# Altium project BIOLAB.PrjPcb
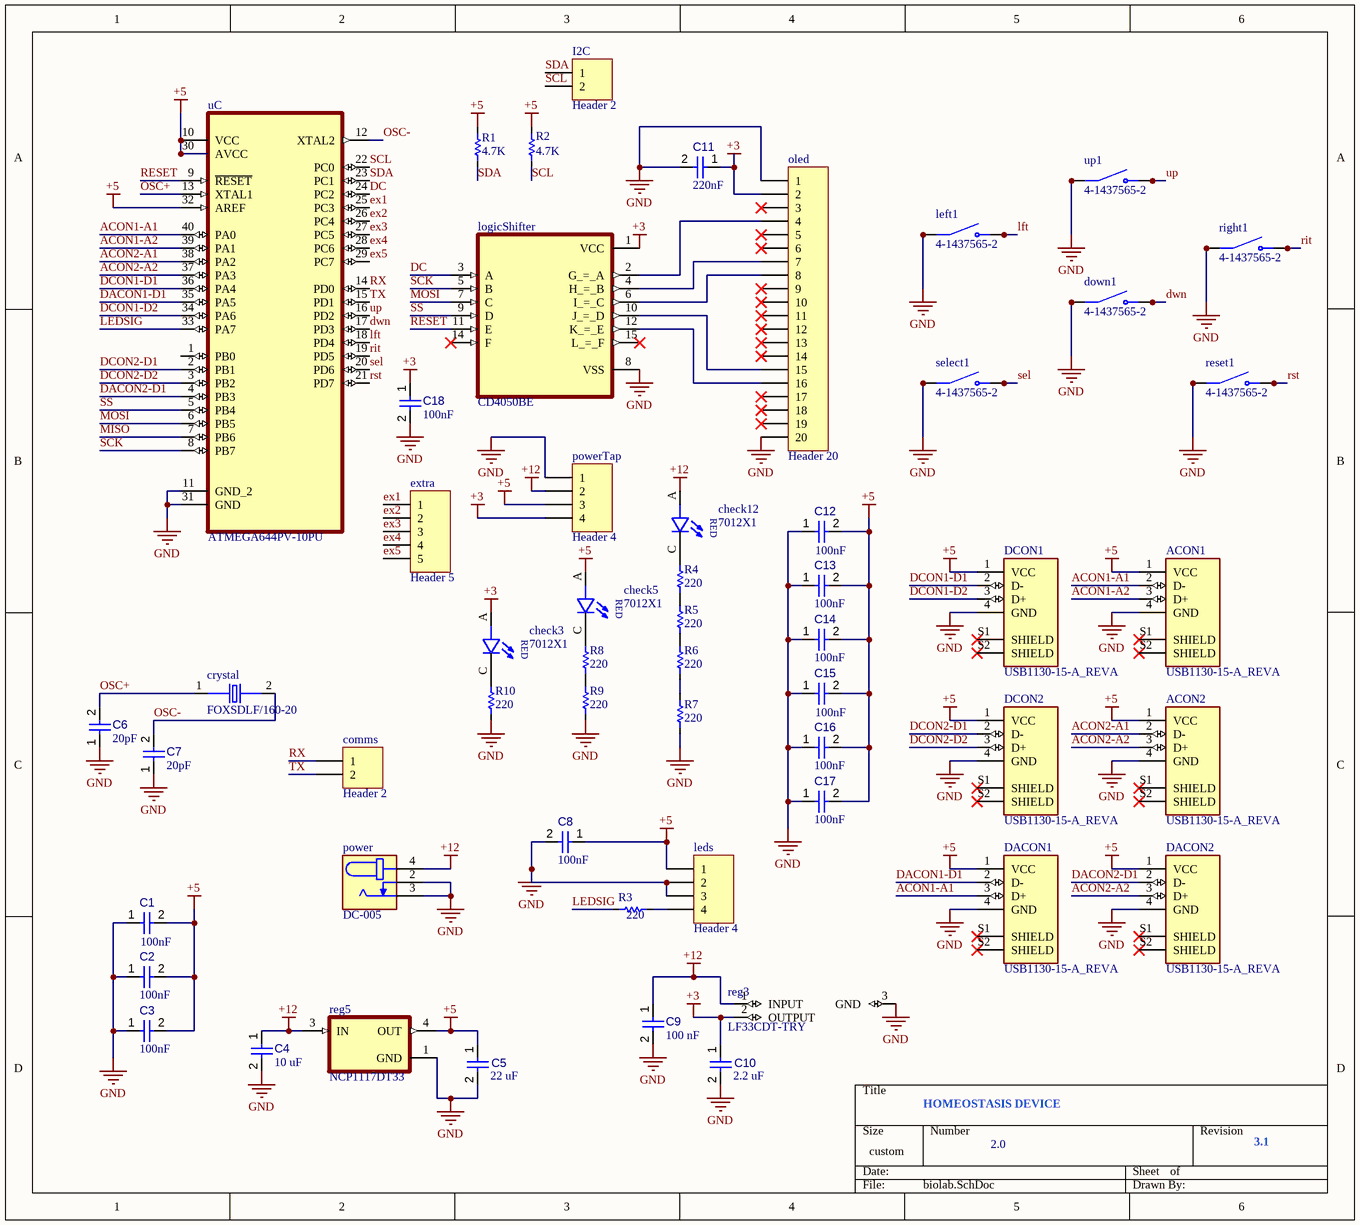
[diagram p0: biolab.SchDoc]
1 sheet, 55 parts. Net scope: global (net labels, ports and power ports of the same name join across sheets).
Board file: biolab.PcbDoc

## Sheet biolab.SchDoc
size 254 x 228 mm; SheetNumber: 1; SheetTotal: 1

### Parts
ACON1  USB1130-15-A_REVA  [GCT_USB1130-15-A_REVA]
ACON2  USB1130-15-A_REVA  [GCT_USB1130-15-A_REVA]
C1  value 100nF  [CAPC0805(2012)145_L]  (hidden comment: Capacitor 4.7µF +/-40% 25V 0805)
C2  value 100nF  [CAPC0805(2012)145_L]  (hidden comment: Capacitor 4.7µF +/-40% 25V 0805)
C3  value 100nF  [CAPC0805(2012)145_L]  (hidden comment: Capacitor 4.7µF +/-40% 25V 0805)
C4  value 10 uF  [CAPC0805(2012)145_L]  (hidden comment: Capacitor 4.7µF +/-40% 25V 0805)
C5  value 22 uF  [CAPC0805(2012)145_L]  (hidden comment: Capacitor 4.7µF +/-40% 25V 0805)
C6  value 20pF  [CAPC2013X135X45ML10T25]  (hidden comment: Capacitor 1 uF +/- 10% 50 V 0805)
C7  value 20pF  [CAPC2013X135X45ML10T25]  (hidden comment: Capacitor 1 uF +/- 10% 50 V 0805)
C8  value 100nF  [CAPC0805(2012)145_L]  (hidden comment: Capacitor 4.7µF +/-40% 25V 0805)
C9  value 100 nF  [CAPC0805(2012)145_L]  (hidden comment: Capacitor 4.7µF +/-40% 25V 0805)
C10  value 2.2 uF  [CAPC0805(2012)145_L]  (hidden comment: Capacitor 4.7µF +/-40% 25V 0805)
C11  value 220nF  [CAPC0805(2012)145_L]  (hidden comment: Capacitor 4.7µF +/-40% 25V 0805)
C12  value 100nF  [CAPC0805(2012)145_L]  (hidden comment: Capacitor 4.7µF +/-40% 25V 0805)
C13  value 100nF  [CAPC0805(2012)145_L]  (hidden comment: Capacitor 4.7µF +/-40% 25V 0805)
C14  value 100nF  [CAPC0805(2012)145_L]  (hidden comment: Capacitor 4.7µF +/-40% 25V 0805)
C15  value 100nF  [CAPC0805(2012)145_L]  (hidden comment: Capacitor 4.7µF +/-40% 25V 0805)
C16  value 100nF  [CAPC0805(2012)145_L]  (hidden comment: Capacitor 4.7µF +/-40% 25V 0805)
C17  value 100nF  [CAPC0805(2012)145_L]  (hidden comment: Capacitor 4.7µF +/-40% 25V 0805)
C18  value 100nF  [CAPC0805(2012)145_L]  (hidden comment: Capacitor 4.7µF +/-40% 25V 0805)
check3  7012X1  [LED_7012X1]
check5  7012X1  [LED_7012X1]
check12  7012X1  [LED_7012X1]
comms  Header 2  [HDR1X2]
crystal  FOXSDLF/160-20  [XTAL_FOXSDLF/160-20]
DACON1  USB1130-15-A_REVA  [GCT_USB1130-15-A_REVA]
DACON2  USB1130-15-A_REVA  [GCT_USB1130-15-A_REVA]
DCON1  USB1130-15-A_REVA  [GCT_USB1130-15-A_REVA]
DCON2  USB1130-15-A_REVA  [GCT_USB1130-15-A_REVA]
down1  4-1437565-2  [SW_4-1437565-2]
extra  Header 5  [HDR1X5]
I2C  Header 2  [HDR1X2]
leds  Header 4  [HDR1X4]
left1  4-1437565-2  [SW_4-1437565-2]
logicShifter  CD4050BE  [DIP794W45P254L1969H508Q16]
oled  Header 20  [HDR1X20]
power  DC-005  [NINIGI_DC-005]
powerTap  Header 4  [HDR1X4]
R1  value 4.7K  [0805_Resistor]  (hidden comment: R_0805_4.7K_1%)
R2  value 4.7K  [0805_Resistor]  (hidden comment: R_0805_4.7K_1%)
R3  value 220  [0805_Resistor]  (hidden comment: R_0805_4.7K_1%)
R4  value 220  [0805_Resistor]  (hidden comment: R_0805_4.7K_1%)
R5  value 220  [0805_Resistor]  (hidden comment: R_0805_4.7K_1%)
R6  value 220  [0805_Resistor]  (hidden comment: R_0805_4.7K_1%)
R7  value 220  [0805_Resistor]  (hidden comment: R_0805_4.7K_1%)
R8  value 220  [0805_Resistor]  (hidden comment: R_0805_4.7K_1%)
R9  value 220  [0805_Resistor]  (hidden comment: R_0805_4.7K_1%)
R10  value 220  [0805_Resistor]  (hidden comment: R_0805_4.7K_1%)
reg3  LF33CDT-TRY  [LD1117DT33]
reg5  NCP1117DT33  [VREG_NCP1117DT33]
reset1  4-1437565-2  [SW_4-1437565-2]
right1  4-1437565-2  [SW_4-1437565-2]
select1  4-1437565-2  [SW_4-1437565-2]
uC  ATMEGA644PV-10PU  [DIP254P1524X483-40]
up1  4-1437565-2  [SW_4-1437565-2]

### Nets
+3: C10.1 C11.1 C18.1 check3.A logicShifter.1(VCC) oled.2 powerTap.4 reg3.2(OUTPUT)
+5: ACON1.1(VCC) ACON2.1(VCC) C1.2 C2.2 C3.2 C5.1 C8.1 C12.2 C13.2 C14.2 C15.2 C16.2 C17.2 check5.A DACON1.1(VCC) DACON2.1(VCC) DCON1.1(VCC) DCON2.1(VCC) leds.1 powerTap.3 R1.1 R2.1 reg5.4(OUT) uC.10(VCC) uC.30(AVCC) uC.32(AREF)
+12: C4.1 C9.1 check12.A power.4 powerTap.2 reg3.1(INPUT) reg5.3(IN)
GND: ACON1.4(GND) ACON2.4(GND) C1.1 C2.1 C3.1 C4.2 C5.2 C6.1 C7.1 C8.2 C9.2 C10.2 C11.2 C12.1 C13.1 C14.1 C15.1 C16.1 C17.1 C18.2 DACON1.4(GND) DACON2.4(GND) DCON1.4(GND) DCON2.4(GND) down1.1(COM) down1.2(COM) leds.2 leds.3 left1.1(COM) left1.2(COM) logicShifter.8(VSS) oled.1 oled.20 power.2 power.3 powerTap.1 R7.1 R9.1 R10.1 reg3.3(GND) reg5.1(GND) reset1.1(COM) reset1.2(COM) right1.1(COM) right1.2(COM) select1.1(COM) select1.2(COM) uC.11(GND_2) uC.31(GND) up1.1(COM) up1.2(COM)
ACON1-A1: ACON1.2(D-) DACON1.3(D+) uC.40(PA0)
ACON1-A2: ACON1.3(D+) uC.39(PA1)
ACON2-A1: ACON2.2(D-) uC.38(PA2)
ACON2-A2: ACON2.3(D+) DACON2.3(D+) uC.37(PA3)
DACON1-D1: DACON1.2(D-) uC.35(PA5)
DACON2-D1: DACON2.2(D-) uC.4(PB3)
DC: logicShifter.3(A) uC.24(PC2)
DCON1-D1: DCON1.2(D-) uC.36(PA4)
DCON1-D2: DCON1.3(D+) uC.34(PA6)
DCON2-D1: DCON2.2(D-) uC.2(PB1)
DCON2-D2: DCON2.3(D+) uC.3(PB2)
dwn: down1.3(NO) down1.4(NO) uC.17(PD3)
ex1: extra.1 uC.25(PC3)
ex2: extra.2 uC.26(PC4)
ex3: extra.3 uC.27(PC5)
ex4: extra.4 uC.28(PC6)
ex5: extra.5 uC.29(PC7)
LEDSIG: R3.1 uC.33(PA7)
lft: left1.3(NO) left1.4(NO) uC.18(PD4)
MISO: uC.7(PB6)
MOSI: logicShifter.7(C) uC.6(PB5)
OSC+: C6.2 crystal.1 uC.13(XTAL1)
OSC-: C7.2 crystal.2 uC.12(XTAL2)
RESET: logicShifter.11(E) uC.9(~{RESET})
rit: right1.3(NO) right1.4(NO) uC.19(PD5)
rst: reset1.3(NO) reset1.4(NO) uC.21(PD7)
RX: comms.1 uC.14(PD0)
SCK: logicShifter.5(B) uC.8(PB7)
SCL: I2C.2 R2.2 uC.22(PC0)
SDA: I2C.1 R1.2 uC.23(PC1)
sel: select1.3(NO) select1.4(NO) uC.20(PD6)
SS: logicShifter.9(D) uC.5(PB4)
TX: comms.2 uC.15(PD1)
up: uC.16(PD2) up1.3(NO) up1.4(NO)
Netcheck3_C: check3.C R10.2
Netcheck5_C: check5.C R8.2
Netcheck12_C: check12.C R4.2
Netleds_4: leds.4 R3.2
NetlogicShifter_2: logicShifter.2(G_=_A) oled.4
NetlogicShifter_4: logicShifter.4(H_=_B) oled.7
NetlogicShifter_6: logicShifter.6(I_=_C) oled.8
NetlogicShifter_10: logicShifter.10(J_=_D) oled.15
NetlogicShifter_12: logicShifter.12(K_=_E) oled.16
NetR4_1: R4.1 R5.2
NetR5_1: R5.1 R6.2
NetR6_1: R6.1 R7.2
NetR8_1: R8.1 R9.2

Not connected (* = marked no-connect by the designer): ACON1 S1(SHIELD)* S2(SHIELD)*; ACON2 S1(SHIELD)* S2(SHIELD)*; DACON1 S1(SHIELD)* S2(SHIELD)*; DACON2 S1(SHIELD)* S2(SHIELD)*; DCON1 S1(SHIELD)* S2(SHIELD)*; DCON2 S1(SHIELD)* S2(SHIELD)*; logicShifter 14(F)* 15(L_=_F)*; oled 3* 5* 6* 9* 10* 11* 12* 13* 14* 17* 18* 19*; uC 1(PB0)

### Notes on the sheet
- HOMEOSTASIS DEVICE
- 2.0
- 3.1
- (in symbol 7012X1) RED

### Library data of the parts
ACON1 ACON2 DACON1 DACON2 DCON1 DCON2 = USB1130-15-A_REVA: MF: {'manufacturer': u'Global Connector Technology'}; MP: USB1130-15-A_REVA; Value: *; Price: None; Package: None; Availability: Unavailable
C1-C5 C8-C18 = CMP-001-00080-5: Chip Capacitor, 4.7µF +/-40%, 25V, 0805, Thickness 1.45 mm; Tolerance: 20%; Capacitor Type: Ceramic; Case/Package: 0805; Max Operating Temperature: 85°C; Mounting Technology: SMT; Min Operating Temperature: -55°C; Voltage Rating: 25V; Pins: 2
C6 C7 = CMP-001-00007-7: Chip Capacitor, 1 uF, +/- 10%, 50 V, 0805 (2012 Metric); Capacitor Type: Ceramic; Voltage Rating: 50V; Mounting Technology: SMT; Tolerance: 10%; Pins: 2; Max Operating Temperature: 125°C; Min Operating Temperature: -55°C; Case/Package: 0805
check3 check5 check12 = 7012X1: Red LED Indication - Discrete 1.7V 0805 (2012 Metric); MF: {'manufacturer': u'Visual'}; Availability: Unavailable; Value: *; Package: None; MP: 7012X1; Price: None
comms I2C = Header 2: Header, 2-Pin; LatestRevisionDate: 17-Jul-2002; LatestRevisionNote: Re-released for DXP Platform.; Publisher: Altium Limited
crystal = FOXSDLF/160-20: Crystal 16MHz 20pF 2-Pin HC-49/SD; MF: {'manufacturer': u'Fox Electronics'}; Value: *; Availability: Unavailable; Package: None; MP: FOXSDLF/160-20; Price: None
down1 left1 reset1 right1 select1 up1 = 4-1437565-2: MF: {'manufacturer': u'TE Connectivity'}; Price: None; MP: 4-1437565-2; Availability: Unavailable; Package: None; Value: *
extra = Header 5: Header, 5-Pin; LatestRevisionDate: 17-Jul-2002; LatestRevisionNote: Re-released for DXP Platform.; Publisher: Altium Limited
leds powerTap = Header 4: Header, 4-Pin; LatestRevisionDate: 17-Jul-2002; LatestRevisionNote: Re-released for DXP Platform.; Publisher: Altium Limited
logicShifter = CD4050BE: MF: {'manufacturer': u'Texas Instruments'}; Package: None; Availability: Unavailable; Price: None; MP: CD4050BE; Value: *
oled = Header 20: Header, 20-Pin; LatestRevisionDate: 17-Jul-2002; LatestRevisionNote: Re-released for DXP Platform.; Publisher: Altium Limited
power = DC-005: DC Jack; MF: {'manufacturer': u'Best Inc.'}; Package: None; Availability: Unavailable; Price: None; MP: DC-005; Value: *
R1-R10 = CMP-058-000045-1: RES 4.7K OHM 1/8W 1% 0805 SMD; Manufacturer: Yageo; Manufacturer Part Number: AC0805FR-074K7L; SVP Creator: Andrew Wu; Power Rating: 0.125W; ComponentLink1Description: DigiKey; Source: resistor.SchLib; Design Item ID: R_0805_4.7K_1%; Package: 0805_Resistor; DigiKey PN: YAG3738TR-ND; ComponentLink1URL: https://www.digikey.com/products/en?keywords=YAG3738TR-ND
reg3 = LF33CDT-TRY: <b>Linear Voltage Regulators VLDV Reg Inhibit 0.45V 50uA 500mA</b><p> Source: <a href="https://componentsearchengine.com/Datasheets/1/LF33CDT-TRY.pdf"> Datasheet </a>; MF: {'manufacturer': u'STMicroelectronics'}; Availability: Unavailable; Value: *; Package: None; MP: LF33CDT-TRY; Price: None
reg5 = NCP1117DT33: 1.0 A Positive LDO Linear Voltage Regulator (Fixed and Adjustable) Vout: 3.3 V; MF: {'manufacturer': u'ON Semiconductor'}; Availability: Unavailable; MP: NCP1117DT33; Value: *; Price: None; Package: None
uC = ATMEGA644PV-10PU: 8-bit Microcontroller with In-System Programmable  Flash; MF: {'manufacturer': u'Microchip Technology'}; Availability: Unavailable; MP: ATMEGA644PV-10PU; Value: *; Price: None; Package: None